# EAGLE design janus (EAGLE 7.5.0)
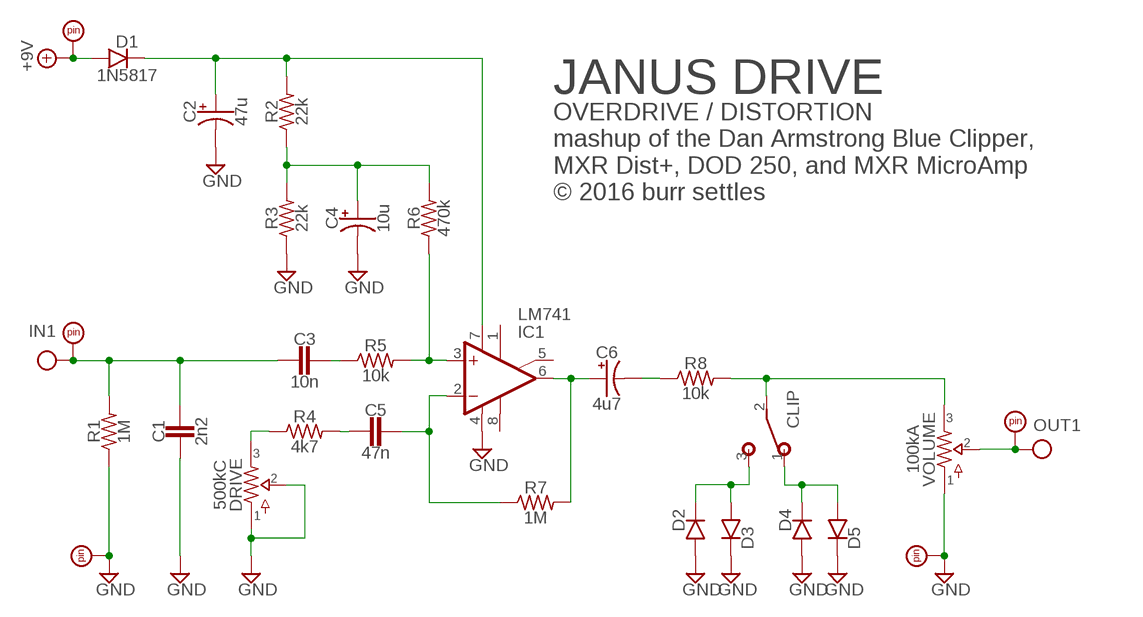
[diagram p0: schematic, sheet 1]

## Parts
C1  2n2  CER/FILMBOX.1  [BOX_SMALL]
C2  47u  0501  [050_020_1]
C3  10n  CER/FILMBOX.1  [BOX_SMALL]
C4  10u  0501  [050_020_1]
C5  47n  CER/FILMBOX.1  [BOX_SMALL]
C6  4u7  0501  [050_020_1]
CLIP  SPDTPADS  [SPDT]
D1  1N5817  DO41.2  [DO41-2]
D2  DO35.2  [DO35-2]
D3  DO35.2  [DO35-2]
D4  DO35.3  [DO35-3]
D5  DO35.3  [DO35-3]
DRIVE  500kC  POTSSMALL_PADS  [PADS_SMALL]
IC1  LM741  SINGLETH  [DIL08]
PAD1  PADSQR  [SQUARE]
PAD2  PADSQR  [SQUARE]
PAD3  PADRND  [ROUND]
PAD4  PADRND  [ROUND]
PAD5  PADSQR  [SQUARE]
R1  1M  R_.3B  [R0207/3]
R2  22k  R_.3B  [R0207/3]
R3  22k  R_.3B  [R0207/3]
R4  4k7  R_.3B  [R0207/3]
R5  10k  R_.3B  [R0207/3]
R6  470k  R_.3B  [R0207/3]
R7  1M  R_.3B  [R0207/3]
R8  10k  R_.3B  [R0207/3]
VOLUME  100kA  POTSSMALL_PADS  [PADS_SMALL]

## Nets
+9V: D1.A PAD1.1
CLIP: CLIP.2(P) R8.2 VOLUME.3
GND: C1.1 C2.- C4.- D2.A D3.C D4.A D5.C DRIVE.1 DRIVE.2 IC1.4(V-) PAD3.1 PAD4.1 R1.1 R3.1 VOLUME.1
IN: C1.2 C3.2 PAD2.1 R1.2
N$1: C3.1 R5.1
N$2: IC1.3(+IN) R5.2 R6.1
N$3: C5.1 IC1.2(-IN) R7.1
N$4: C5.2 R4.2
N$5: C6.+ IC1.6(OUT) R7.2
N$6: C6.- R8.1
N$7: CLIP.3(S) D2.C D3.A
N$8: C4.+ R2.1 R3.2 R6.2
N$9: CLIP.1(O) D4.C D5.A
N$10: DRIVE.3 R4.1
N$12: C2.+ D1.C IC1.7(V+) R2.2
OUT: PAD5.1 VOLUME.2
Unconnected: IC1.1(ON1) IC1.5(ON2) IC1.8(OPT)

## Notes on the sheet
- JANUS DRIVE
- OVERDRIVE / DISTORTION
  mashup of the Dan Armstrong Blue Clipper,
  MXR Dist+, DOD 250, and MXR MicroAmp
  © 2016 burr settles

## Library data of the parts
C1 C3 C5 = capacitors-film:CER/FILM: 47 - 120pF Xicon Ceramic Disc 2.5mm lead spacing
C2 C4 C6 = capacitors-elec:050: 0.22 - 100uF Xicon values at Mouser.com: 10V: 10 - 100uF; 16V: 2.2 - 47uF; 25V: 0.47 - 47uF; 50V: 0.22 - 22uF
CLIP = switches:SPDT: TOGGLE SWITCH Marquardt
D1 = diodes:DO41: DO-41 Package Diodes: 1N4001 - 1N40019 Zener Diodes: 1N4728 - 1N4764
D2-D5 = diodes:DO35: DO-35 Package Diodes: 1N914
DRIVE VOLUME = potentiometers:POTS
IC1 = integrated circuits:SINGLE: OP AMP
PAD1-PAD5 = supply pins:PAD
R1-R8 = resistors:R_

## Board
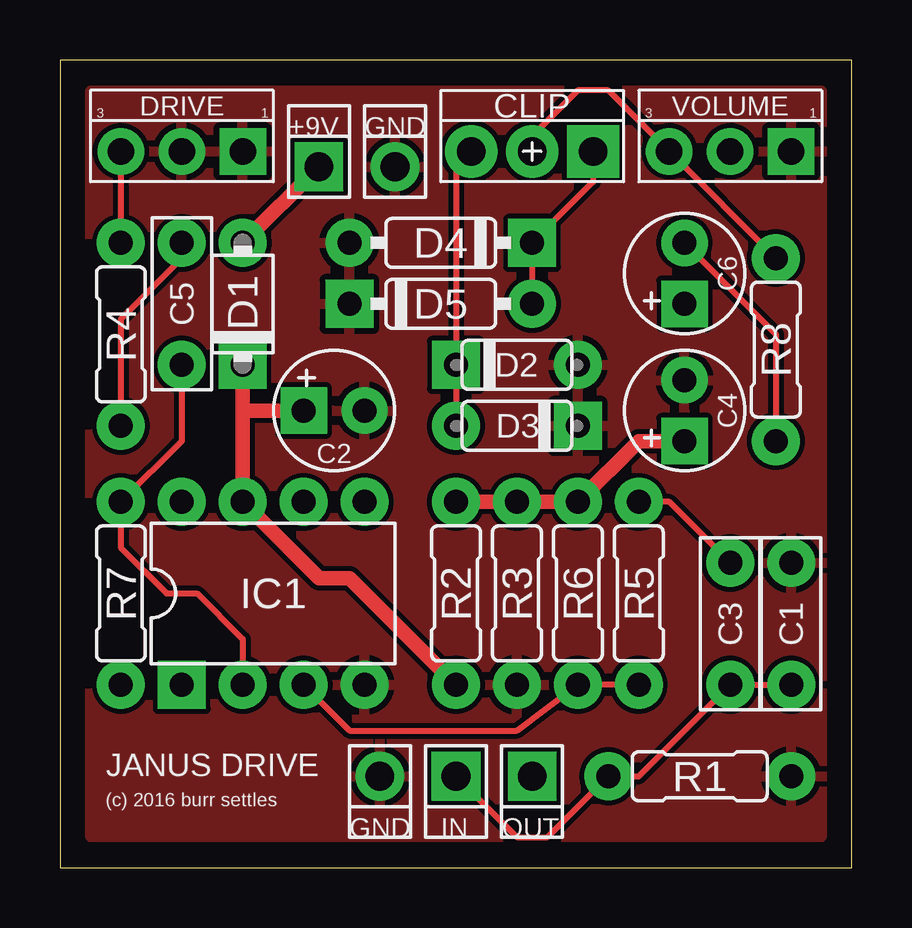
[diagram p1: board, top side]
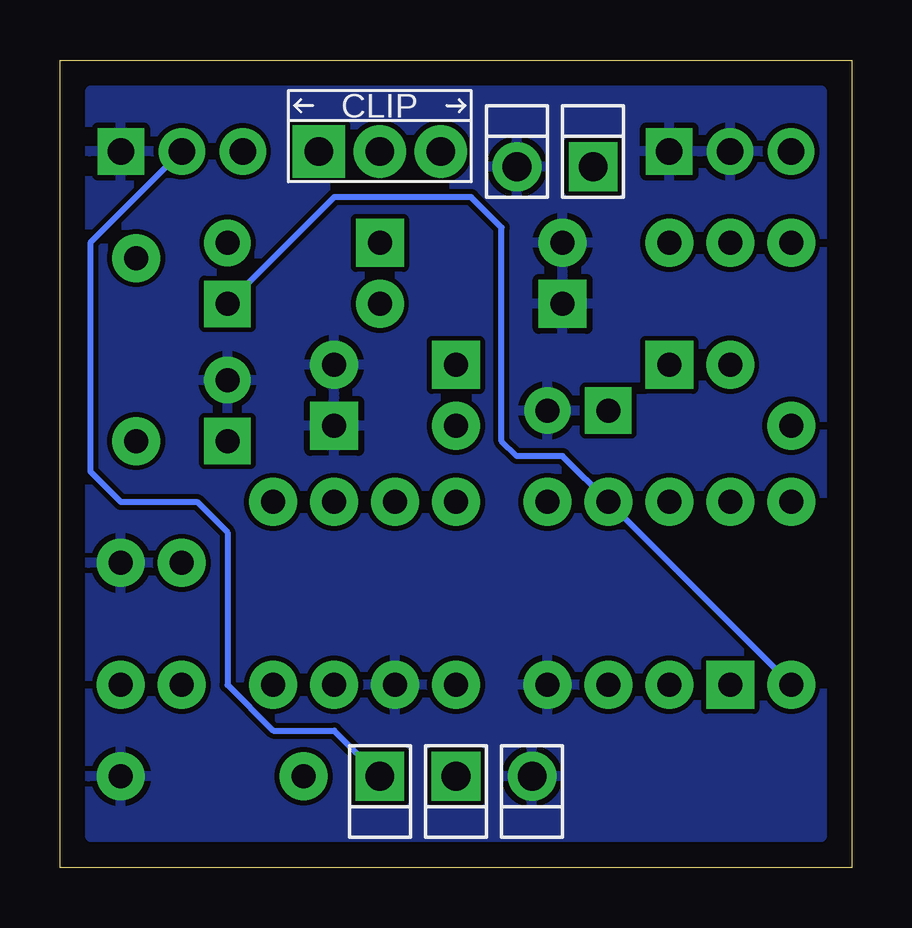
[diagram p2: board, bottom side, seen from below]

Size 33.02 x 33.66 mm. Coordinates in mm from the lower left corner, seen from the top.
Outline: 0,0 33.02,0 33.02,33.66 0,33.66 0,0
Copper layers (1*16): Top 0.035mm / dielectric 1.5mm / Bottom 0.035mm
Design rules "default": minimum track width 10mil, minimum drill 24mil, track to track 8mil, track to pad 8mil, pad to pad 8mil, via to via 8mil, smd to smd 8mil, copper to edge 40mil, drill to drill 8mil, minimum pad ring 10mil, minimum via ring 8mil, stop-mask expansion 4mil, vias tented up to drill 0mil, thermal gap 10mil

### Footprints (pad centres in the part's own frame; a part is rotated, then mirrored left to right if it is on the bottom)
BOX_SMALL = drill 1 pad 2: 1 -2.54,0; 2 2.54,0
050_020_1 = drill 1 pad 1.93 square: + -1.27,0 | drill 1 pad 1.93: - 1.27,0
SPDT = drill 1.2 pad 2.184 square: 1 -2.54,0 | drill 1.2 pad 2.184: 2 0,0; 3 2.54,0
DO41-2 = drill 1 pad 2: A 2.54,0 | drill 1 pad 2 square: C -2.54,0
DO35-2 = drill 1 pad 2: A 2.54,0 | drill 1 pad 2 square: C -2.54,0
DO35-3 = drill 1 pad 2: A 3.81,0 | drill 1 pad 2 square: C -3.81,0
PADS_SMALL = drill 1.1 pad 1.93 square: 1 2.54,0 | drill 1.1 pad 1.93: 2 0,0; 3 -2.54,0
DIL08 = drill 1 pad 2 square: 1 -3.81,-3.81 | drill 1 pad 2: 2 -1.27,-3.81; 3 1.27,-3.81; 4 3.81,-3.81; 5 3.81,3.81; 6 1.27,3.81; 7 -1.27,3.81; 8 -3.81,3.81
SQUARE = drill 1.2 pad 2.032 square: 1 0,0
ROUND = drill 1.2 pad 2.032: 1 0,0
R0207/3 = drill 1 pad 2: 1 -3.81,0; 2 3.81,0

### Placement (x,y rotation side)
C1  30.48,10.16 270 top
C2  11.43,19.05 0 top
C3  27.94,10.16 270 top
C4  26.04,19.05 90 top
C5  5.08,23.5 90 top
C6  26.04,24.77 90 top
CLIP  19.68,29.84 0 bottom
D1  7.62,23.5 90 top
D2  19.05,20.95 0 top
D3  19.05,18.41 180 top
D4  15.88,26.04 180 top
D5  15.88,23.5 0 top
DRIVE  5.08,29.84 0 top
IC1  8.89,11.43 0 top
PAD1  10.79,29.21 180 top
PAD2  16.51,3.81 0 top
PAD3  13.34,3.81 0 top
PAD4  13.97,29.21 180 top
PAD5  19.68,3.81 0 top
R1  26.67,3.81 180 top
R2  16.51,11.43 270 top
R3  19.05,11.43 90 top
R4  2.54,22.23 270 top
R5  24.13,11.43 270 top
R6  21.59,11.43 90 top
R7  2.54,11.43 270 top
R8  29.84,21.59 90 top
VOLUME  27.94,29.84 0 top

### Tracks (layer width: path | path; a pad name or v marks a point on that pad's centre or on a via)
+9V
  Top 0.61: PAD1.1 D1.A
CLIP
  Top 0.254: CLIP.2 19.68,30.48 21.59,32.38 22.86,32.38 VOLUME.3 R8.2
GND
  pour Bottom: 31.75,32.38 1.27,32.38 1.27,1.27 31.75,1.27
  pour Top: 1.27,32.38 31.75,32.38 31.75,1.27 1.27,1.27
IN
  Top 0.254: PAD2.1 19.05,1.27 20.32,1.27 R1.2 24.13,3.81 C3.2 C1.2
N$1
  Top 0.254: R5.1 25.4,15.24 C3.1
N$2
  Top 0.254: IC1.3 12.06,5.71 19.05,5.71 R6.1 R5.2
N$3
  Top 0.254: C5.1 5.08,17.78 R7.1 2.54,13.34 4.45,11.43 5.71,11.43 7.62,9.53 IC1.2
N$4
  Top 0.254: R4.2 2.54,22.86 5.08,25.4 C5.2
N$5
  Bottom 0.254: R7.2 IC1.6 12.06,17.14 13.97,17.14 14.61,17.78 14.61,26.67 15.88,27.94 21.59,27.94 C6.+
N$6
  Top 0.254: R8.1 29.84,22.23 C6.-
N$7
  Top 0.254: CLIP.3 16.51,29.21 D2.C D3.A
N$8
  Top 0.61: R2.1 R3.2 R6.2 24.13,17.78 C4.+
N$9
  Top 0.254: D5.A D4.C 22.23,28.57 CLIP.1
N$10
  Top 0.254: DRIVE.3 R4.1
N$12
  Top 0.61: D1.C 7.62,19.05 | 7.62,19.05 IC1.7 10.79,12.06 12.06,12.06 R2.2 | C2.+ 7.62,19.05
OUT
  Bottom 0.254: VOLUME.2 31.75,26.04 31.75,16.51 30.48,15.24 27.3,15.24 26.04,13.97 26.04,7.62 24.13,5.71 21.59,5.71 PAD5.1

### Text on the board
tNames: +9V | GND | JANUS DRIVE | (c) 2016 burr settles | GND | IN | OUT